# Altium schematic sheet BH3.5-2P.schdoc
size 124 x 99 mm
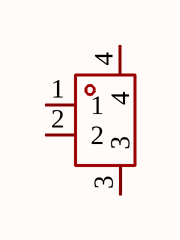
[diagram p0: BH3.5-2P.schdoc]

## Parts
U?  JS350-S02DCA-00  [CONN-SMD_JS350-S02DCA-00]  (value not drawn)

## Nets

Not connected (* = marked no-connect by the designer): U? 1 2 3 4

## Library data of the parts
U? = JS350-S02DCA-00: Manufacturer: JS(钜硕电子); Add into BOM: yes; Pins Structure: 1x2P; Pitch: 3.5mm; Number of PINs Per Row: 2; Current Rating (Max): 1A; Symbol: JS350-S02DCA-00; Device: JS350-S02DCA-00; LCSC Part Name: JS350-S02DCA-00; Supplier Part: C7529566; Manufacturer Part: JS350-S02DCA-00; Supplier Footprint: SMD,P=3.5mm,卧贴; JLCPCB Part Class: Extended Part; Datasheet: https://atta.szlcsc.com/upload/public/pdf/source/20230821/0BD545761CB25B0F1B638F8D5E45A7DB.pdf; Supplier: LCSC; Convert to PCB: yes; Mounting Style: 卧贴; Number of Pins: 2P; Number of Rows: 1; Operating Temperature Range: -25℃~+85℃